# EAGLE design main (EAGLE 6.5.0)
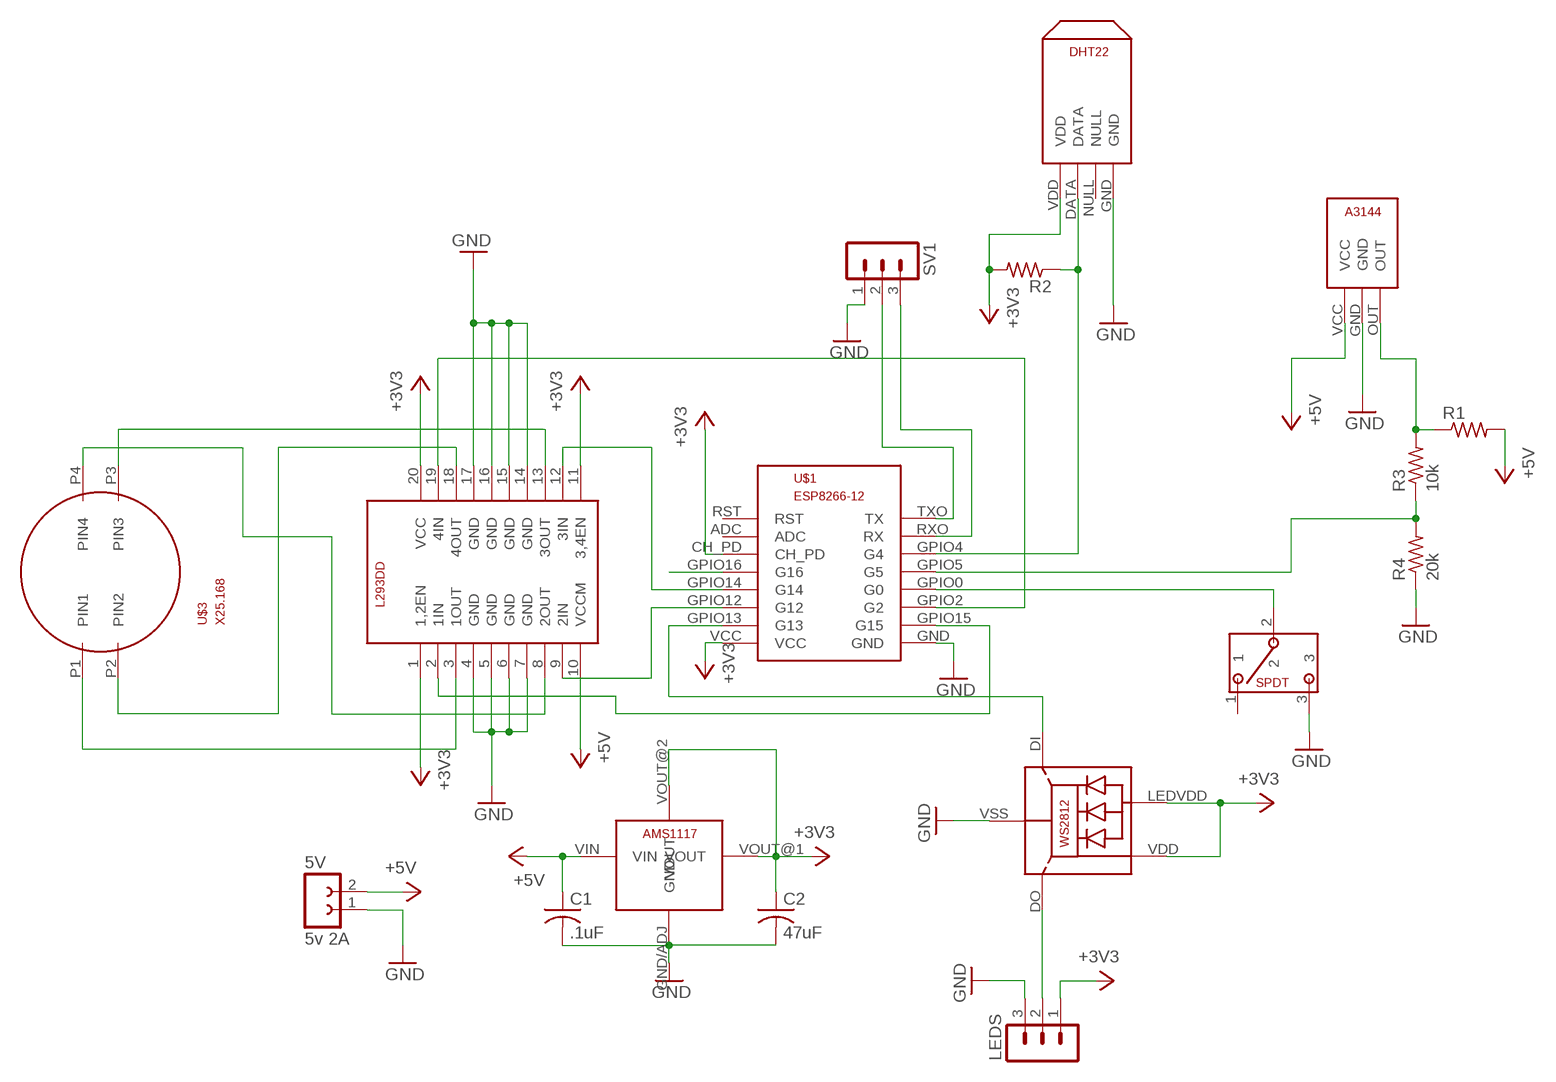
[diagram p0: schematic, sheet 1]

## Parts
5V  5v 2A  FE02-1  [FE02-1]
C1  .1uF  C-USC0805  [C0805]
C2  47uF  C-USC0805  [C0805]
LED1  WS2812  [WS2812]
LEDS  MA03-1  [MA03-1]
R1  R-US_R0805  [R0805]
R2  R-US_R0805  [R0805]
R3  10k  R-US_R0805  [R0805]
R4  20k  R-US_R0805  [R0805]
SV1  MA03-1  [MA03-1]
U$1  ESP12ESP12  [ESP12]
U$3  X25.168X25.SMT  [X25-SMT]
U$4  A3144  [A3144]
U$5  DH22FLAT  [DH22FLAT]
U$6  AMS11173.3V  [AMS1117]
U$7  SMT-SPDT  [SPDT]
U$8  L293DD  [SO20]

## Nets
+3V3: C2.1 LED1.LEDVDD LED1.VDD LEDS.1 R2.2 U$1.CH_PD U$1.VCC U$5.VDD U$6.VOUT@1(VOUT) U$6.VOUT@2(VOUT) U$8.1(1,2EN) U$8.11(3,4EN) U$8.20(VCC)
+5V: 5V.2 C1.1 R1.2 U$4.VCC U$6.VIN U$8.10(VCCM)
GND: 5V.1 C1.2 C2.2 LED1.VSS(GND) LEDS.3 R4.1 SV1.1 U$1.GND U$4.GND U$5.GND U$6.GND/ADJ(GND) U$7.3 U$8.4(GND) U$8.5(GND) U$8.6(GND) U$8.7(GND) U$8.14(GND) U$8.15(GND) U$8.16(GND) U$8.17(GND)
N$1: U$3.P1(PIN1) U$8.3(1OUT)
N$2: U$1.GPIO15(G15) U$8.2(1IN)
N$3: R1.1 R3.2 U$4.OUT
N$4: U$3.P4(PIN4) U$8.8(2OUT)
N$6: R2.1 U$1.GPIO4(G4) U$5.DATA
N$7: LED1.DO LEDS.2
N$8: U$3.P3(PIN3) U$8.13(3OUT)
N$9: SV1.3 U$1.RXO(RX)
N$10: SV1.2 U$1.TXO(TX)
N$11: R3.1 R4.2 U$1.GPIO5(G5)
N$12: LED1.DI U$1.GPIO13(G13)
N$13: U$1.GPIO12(G12) U$8.9(2IN)
N$14: U$1.GPIO14(G14) U$8.12(3IN)
N$15: U$1.GPIO2(G2) U$8.19(4IN)
N$16: U$1.GPIO0(G0) U$7.2
N$17: U$1.GPIO16(G16)
N$18: U$3.P2(PIN2) U$8.18(4OUT)
Unconnected: U$1.ADC U$1.RST U$5.NULL U$7.1

## Library data of the parts
5V = bill:FE02-1: FEMALE HEADER; OC_FARNELL: unknown; OC_NEWARK: unknown
C1 C2 = rcl:C-US: CAPACITOR, American symbol
LED1 = adafruit:WS2812
LEDS SV1 = con-lstb:MA03-1: PIN HEADER; OC_FARNELL: unknown; OC_NEWARK: unknown
R1-R4 = resistor:R-US_: RESISTOR, American symbol
U$1 = bill:ESP12
U$3 = bill:X25.168
U$4 = bill:A3144
U$5 = bill:DH22
U$6 = bill:AMS1117
U$7 = bill:SMT-SPDT
U$8 = bill:L293DD

## Board
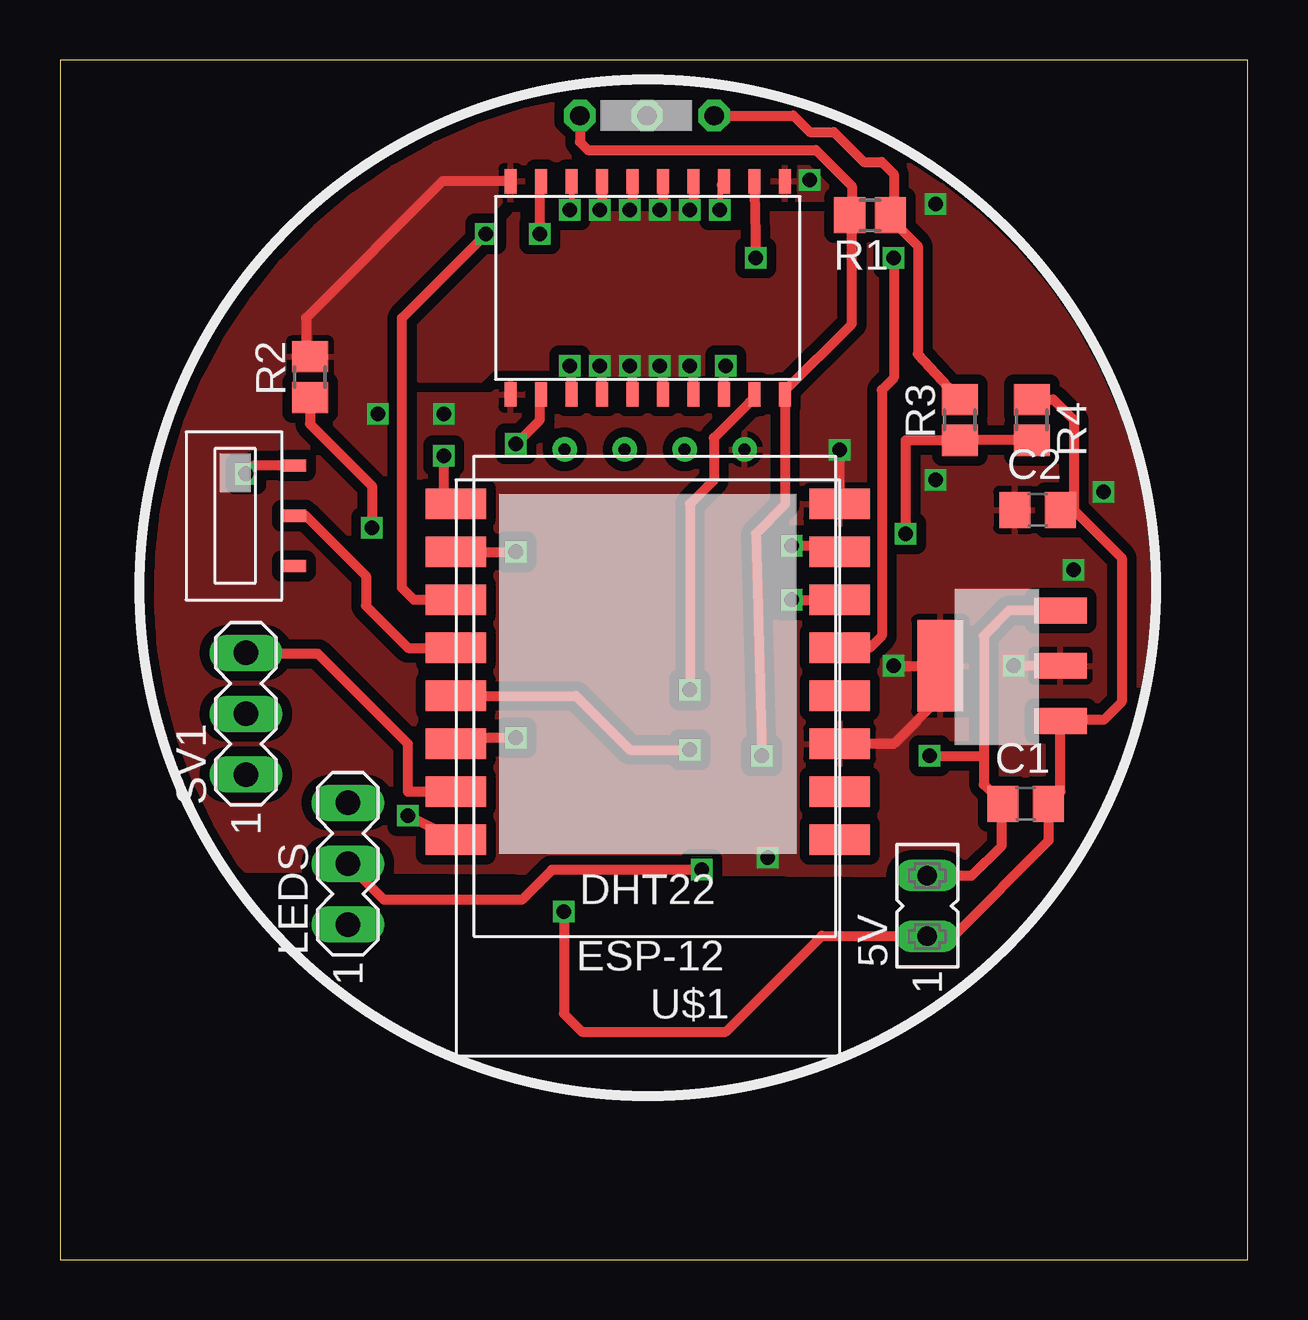
[diagram p1: board, top side]
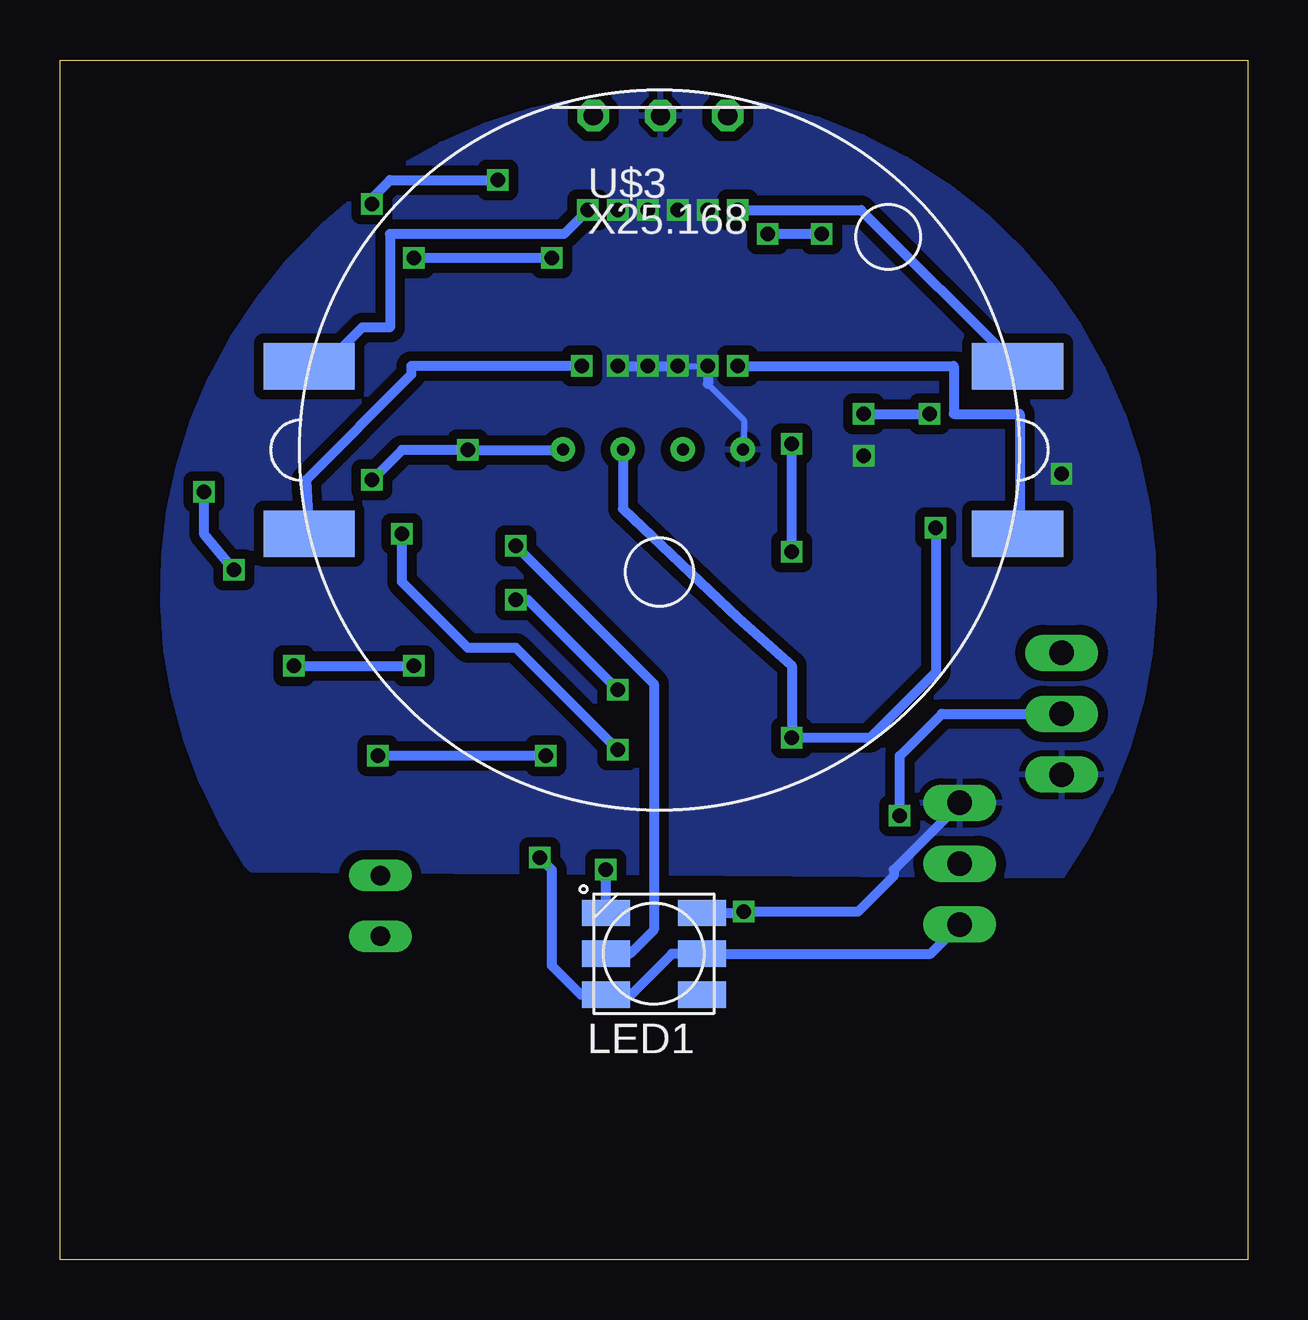
[diagram p2: board, bottom side, seen from below]

Size 49.5 x 50 mm. Coordinates in mm from the lower left corner, seen from the top.
Outline: 0,0 49.5,0 49.5,50 0,50 0,0
Copper layers (1*16): Top 0.035mm / dielectric 1.5mm / Bottom 0.035mm
Design rules "SeeedStudio_2layer_DRU_no_angle_20140221": minimum track width 6mil, minimum drill 12mil, track to track 6mil, track to pad 6mil, pad to pad 6mil, via to via 6mil, smd to smd 0mil, copper to edge 10mil, drill to drill 10mil, minimum pad ring 10mil, minimum via ring 6mil, stop-mask expansion 2mil, vias tented up to drill 100mil, thermal gap 10mil

### Footprints (pad centres in the part's own frame; a part is rotated, then mirrored left to right if it is on the bottom)
FE02-1 = drill 0.813 long: 1 -1.28,0.1; 2 1.26,0.1
C0805 = smd 1.3 x 1.5: 1 -0.95,0; 2 0.95,0
WS2812 = smd 2 x 1.1: DI 2,0; DO 2,-1.7; LEDVDD -2,0; NC -2,1.7; VDD 2,1.7; VSS -2,-1.7
MA03-1 = drill 1.016 long: 1 -2.54,0; 2 0,0; 3 2.54,0
R0805 = smd 1.3 x 1.5: 1 -0.85,0; 2 0.85,0
ESP12 = smd 2.54 x 1.27: ADC -8,1; CH_PD -8,-1; GND 8,-11; GPIO0 8,-5; GPIO2 8,-7; GPIO4 8,-1; GPIO5 8,-3; GPIO12 -8,-7; GPIO13 -8,-9; GPIO14 -8,-5; GPIO15 8,-9; GPIO16 -8,-3; RST -8,3; RXO 8,1; TXO 8,3; VCC -8,-11
X25-SMT = smd 3.81 x 1.93: P1 14.922,-3.493; P2 14.922,3.493; P3 -14.605,3.493; P4 -14.605,-3.493
A3144 = drill 0.8 octagon: GND -2.5,0; OUT 0.3,0; VCC -5.3,0
DH22FLAT = drill 0.5: DATA -1.2,-12.8; GND 3.8,-12.8; NULL 1.3,-12.8; VDD -3.7,-12.8
AMS1117 = smd 1.067 x 2.184: GND/ADJ -2.3,-2.7; VIN 2.3,-2.7; VOUT@1 0,-2.7 | smd 3.81 x 1.93: VOUT@2 0,2.3
SPDT = smd 1.016 x 0.508: 1 -2.5,2.1; 2 -2.5,0; 3 -2.5,-2.1
SO20 = smd 1.016 x 0.508: 1 -4.445,5.715; 2 -4.445,4.445; 3 -4.445,3.175; 4 -4.445,1.905; 5 -4.445,0.635; 6 -4.445,-0.635; 7 -4.445,-1.905; 8 -4.445,-3.175; 9 -4.445,-4.445; 10 -4.445,-5.715; 11 4.445,-5.715; 12 4.445,-4.445; 13 4.445,-3.175; 14 4.445,-1.905; 15 4.445,-0.635; 16 4.445,0.635; 17 4.445,1.905; 18 4.445,3.175; 19 4.445,4.445; 20 4.445,5.715

### Placement (x,y rotation side)
5V  36.25,14.75 90 top
C1  40.25,19 0 top
C2  40.75,31.25 0 top
LED1  24.75,12.75 180 bottom
LEDS  12,16.5 90 top
R1  33.77,43.53 180 top
R2  10.42,36.78 90 top
R3  37.5,35 90 top
R4  40.5,35 270 top
SV1  7.75,22.75 90 top
U$1  24.5,20.5 180 top
U$3  24.51,33.74 0 bottom
U$4  26.97,47.68 0 top
U$5  24.84,20.97 180 top
U$6  39,24.75 90 top
U$7  7.25,31 180 top
U$8  24.5,40.5 90 top

### Tracks (layer width: path | path; a pad name or v marks a point on that pad's centre or on a via)
+3V3  (via drill 0.6)
  Top 0.254: 10.25,37.8 R2.2
  Top 0.406: U$1.CH_PD 34.75,21.5 36.7,23.45 U$6.VOUT@2 v34.75,24.75 | 39.55,31.5 C2.1 | U$6.VOUT@1 v39.75,24.75 | U$8.20 15.95,44.95 10.25,39.25 10.25,37.8 | U$1.VCC v32.5,33.75
  Bottom 0.406: v39.75,24.75 v34.75,24.75 | LEDS.1 13.21,12.75 LED1.LEDVDD 24,12.75 25.75,11 26.7,11 LED1.VDD 27.8,11.05 29,12.25 29,16.25 v29.5,16.75 | U$5.VDD 28.56,33.75 v32.5,33.75 35.25,33.75 v36.5,32.5 | v16,35.25 v13.25,35.25 | v36.5,44 36.5,44.25 35.75,45 v31.25,45 | v42.25,28.75 43.5,30.25 v43.5,32
  pour Top (isolate 0.406, rank 2): 41.5,16 7.75,16.25 7.5,16.5 arc-70 8,40 arc-180
+5V  (via drill 0.6)
  Top 0.406: U$4.VCC 21.67,46.58 22,46.25 31.5,46.25 33,44.75 33,43.61 R1.2 33,43.45 33,39 30.21,36.22 U$8.10 30.21,31.46 29,30.25 v29.25,21 | U$6.VIN 39.55,27.05 38.5,26 38.5,21 | 38.5,21 38.5,19.8 C1.1 39.25,18.95 39.25,17.25 38.01,16.01 5V.2 | v36.25,21 38.5,21
  Bottom 0.406: v29.25,21 v36.25,21
GND  (via drill 0.6)
  Top 0.406: C2.2 42.25,31.25 | 42.25,31.25 44.25,29.25 44.25,23.25 43.5,22.5 41.75,22.5 U$6.GND/ADJ 41.7,19.5 C1.2 41.2,17.45 37.25,13.5 36.18,13.5 5V.1 36.12,13.5 31.75,13.5 27.75,9.5 21.75,9.5 21,10.25 v21,14.5 | U$8.4 22.59,37.16 v22.5,37.25 | U$8.5 23.86,37.13 v23.75,37.25 | U$8.6 25.14,37.12 v25,37.25 | U$8.7 26.41,37.09 v26.25,37.25 | U$7.3 8.1,33.1 v7.75,32.75 | U$8.17 22.59,43.84 v22.5,43.75 | U$8.16 23.86,43.87 v23.75,43.75 | U$8.15 25.14,43.88 v25,43.75 | U$8.14 26.41,43.91 v26.25,43.75 | R4.1 41.4,35.85 42.25,35 42.25,31.25 | U$1.GND 16,32 v16,33.5
  Bottom 0.254: 22.5,36.5 21,35 21,33.81 U$5.GND | v23.75,37.25 v22.5,37.25
  Bottom 0.406: v22.5,37.25 22.5,36.5 | v23.75,37.25 v25,37.25 v26.25,37.25 | LED1.VSS 21.05,14.45 v21,14.5 16.25,14.5 14.75,16 14.75,16.25 12,19 LEDS.3
  pour Bottom (isolate 0.406): 7.75,16 41.5,16.25 41.75,16.5 arc70 41.25,40 arc180
  pour Top (isolate 0.406): 21,37.25 18,37.25 17.5,36.75 15,36.75 15,39.5 19,43.5 32.25,43.5 32.25,38.5 32.5,38.25 31.75,38.25 30.5,37 21.75,37 21.5,37.25
N$1  (via drill 0.6)
  Top 0.406: U$8.3 21.32,37.17 v21.25,37.25
  Bottom 0.406: v21.25,37.25 12.25,37.25 12.25,35.25 9.5,35.25 9.5,30.34 U$3.P1
N$2  (via drill 0.6)
  Top 0.406: U$1.GPIO15 v19,29.5 | v19,34 20,35 20,36 U$8.2
  Bottom 0.406: v19,29.5 v19,34
N$3
  Top 0.406: U$4.OUT 30.57,47.68 31.25,47 32.25,47 33.5,45.75 34.25,45.75 34.75,45.25 34.75,43.66 R1.1 34.62,43.38 35.75,42.25 35.75,37.75 R3.2
N$4  (via drill 0.6)
  Top 0.406: U$8.8 27.68,37.17 v27.75,37.25
  Bottom 0.406: v27.75,37.25 34.86,37.25 34.86,36.89 39.25,32.5 U$3.P4
N$6  (via drill 0.6)
  Top 0.406: R2.1 10.42,34.83 13,32.25 v13,30.5 | v19,21.75 16.75,21.75 U$1.GPIO4
  Bottom 0.406: v13,30.5 13,24.5 15.75,21.75 v19,21.75 19,24.75 21.25,26.75 26.04,31.29 U$5.DATA
N$7  (via drill 0.6)
  Top 0.406: v26.75,16.25 20.5,16.25 19.25,15 13.5,15 LEDS.2
  Bottom 0.406: LED1.DO v26.75,16.25
N$8  (via drill 0.6)
  Top 0.254: U$8.13 arc90 27.5,44.77 v27.5,43.75
  Bottom 0.406: v27.5,43.75 28.5,42.75 35.75,42.75 35.75,38.85 36.9,38.85 38.5,37.25 U$3.P3
N$9
  Top 0.406: U$1.RXO 14.5,19.5 14.5,21.5 10.75,25.25 7.79,25.25 SV1.3
N$10  (via drill 0.6)
  Top 0.406: U$1.TXO v14.5,18.5
  Bottom 0.406: v14.5,18.5 14.5,21 12.75,22.75 SV1.2
N$11  (via drill 0.6)
  Top 0.406: R4.2 R3.1 35.25,34.15 v35.25,30.25 | U$1.GPIO5 21.5,23.5 23.75,21.25 v26.25,21.25
  Bottom 0.406: v26.25,21.25 30.5,25.5 32.5,25.5 35.25,28.25 v35.25,30.25
N$12  (via drill 0.6)
  Top 0.406: U$1.GPIO13 32.25,29.75 v30.5,29.75
  Bottom 0.406: v30.5,29.75 24.75,24 24.75,13.75 25.75,12.75 LED1.DI
N$13  (via drill 0.6)
  Top 0.406: U$8.9 28.95,35.8 29,35.75 28.75,35.75 27.25,34.25 27.25,32.5 26.25,31.5 v26.25,23.75 | v30.5,27.5 U$1.GPIO12
  Bottom 0.406: v26.25,23.75 30,27.5 v30.5,27.5
N$14  (via drill 0.6)
  Top 0.406: U$8.12 28.95,44.55 v29,41.75 | v34.75,41.75 34.75,36.75 34.25,36.25 34.25,26 33.75,25.5 U$1.GPIO14
  Bottom 0.406: v29,41.75 v34.75,41.75
N$15  (via drill 0.6)
  Top 0.406: U$1.GPIO2 14.75,27.5 14.25,28 14.25,39.25 v17.75,42.75 | v20,42.75 20,44.89 U$8.19
  Bottom 0.406: v17.75,42.75 v20,42.75
N$16
  Top 0.406: U$7.2 10.25,31 12.75,28.5 12.75,27.25 14.5,25.5 U$1.GPIO0
N$18  (via drill 0.6)
  Top 0.254: U$8.18 21.32,43.83 v21.25,43.75
  Bottom 0.406: v21.25,43.75 16.11,43.75 U$3.P2